# Altium schematic sheet PowerBoard.SchDoc
size B
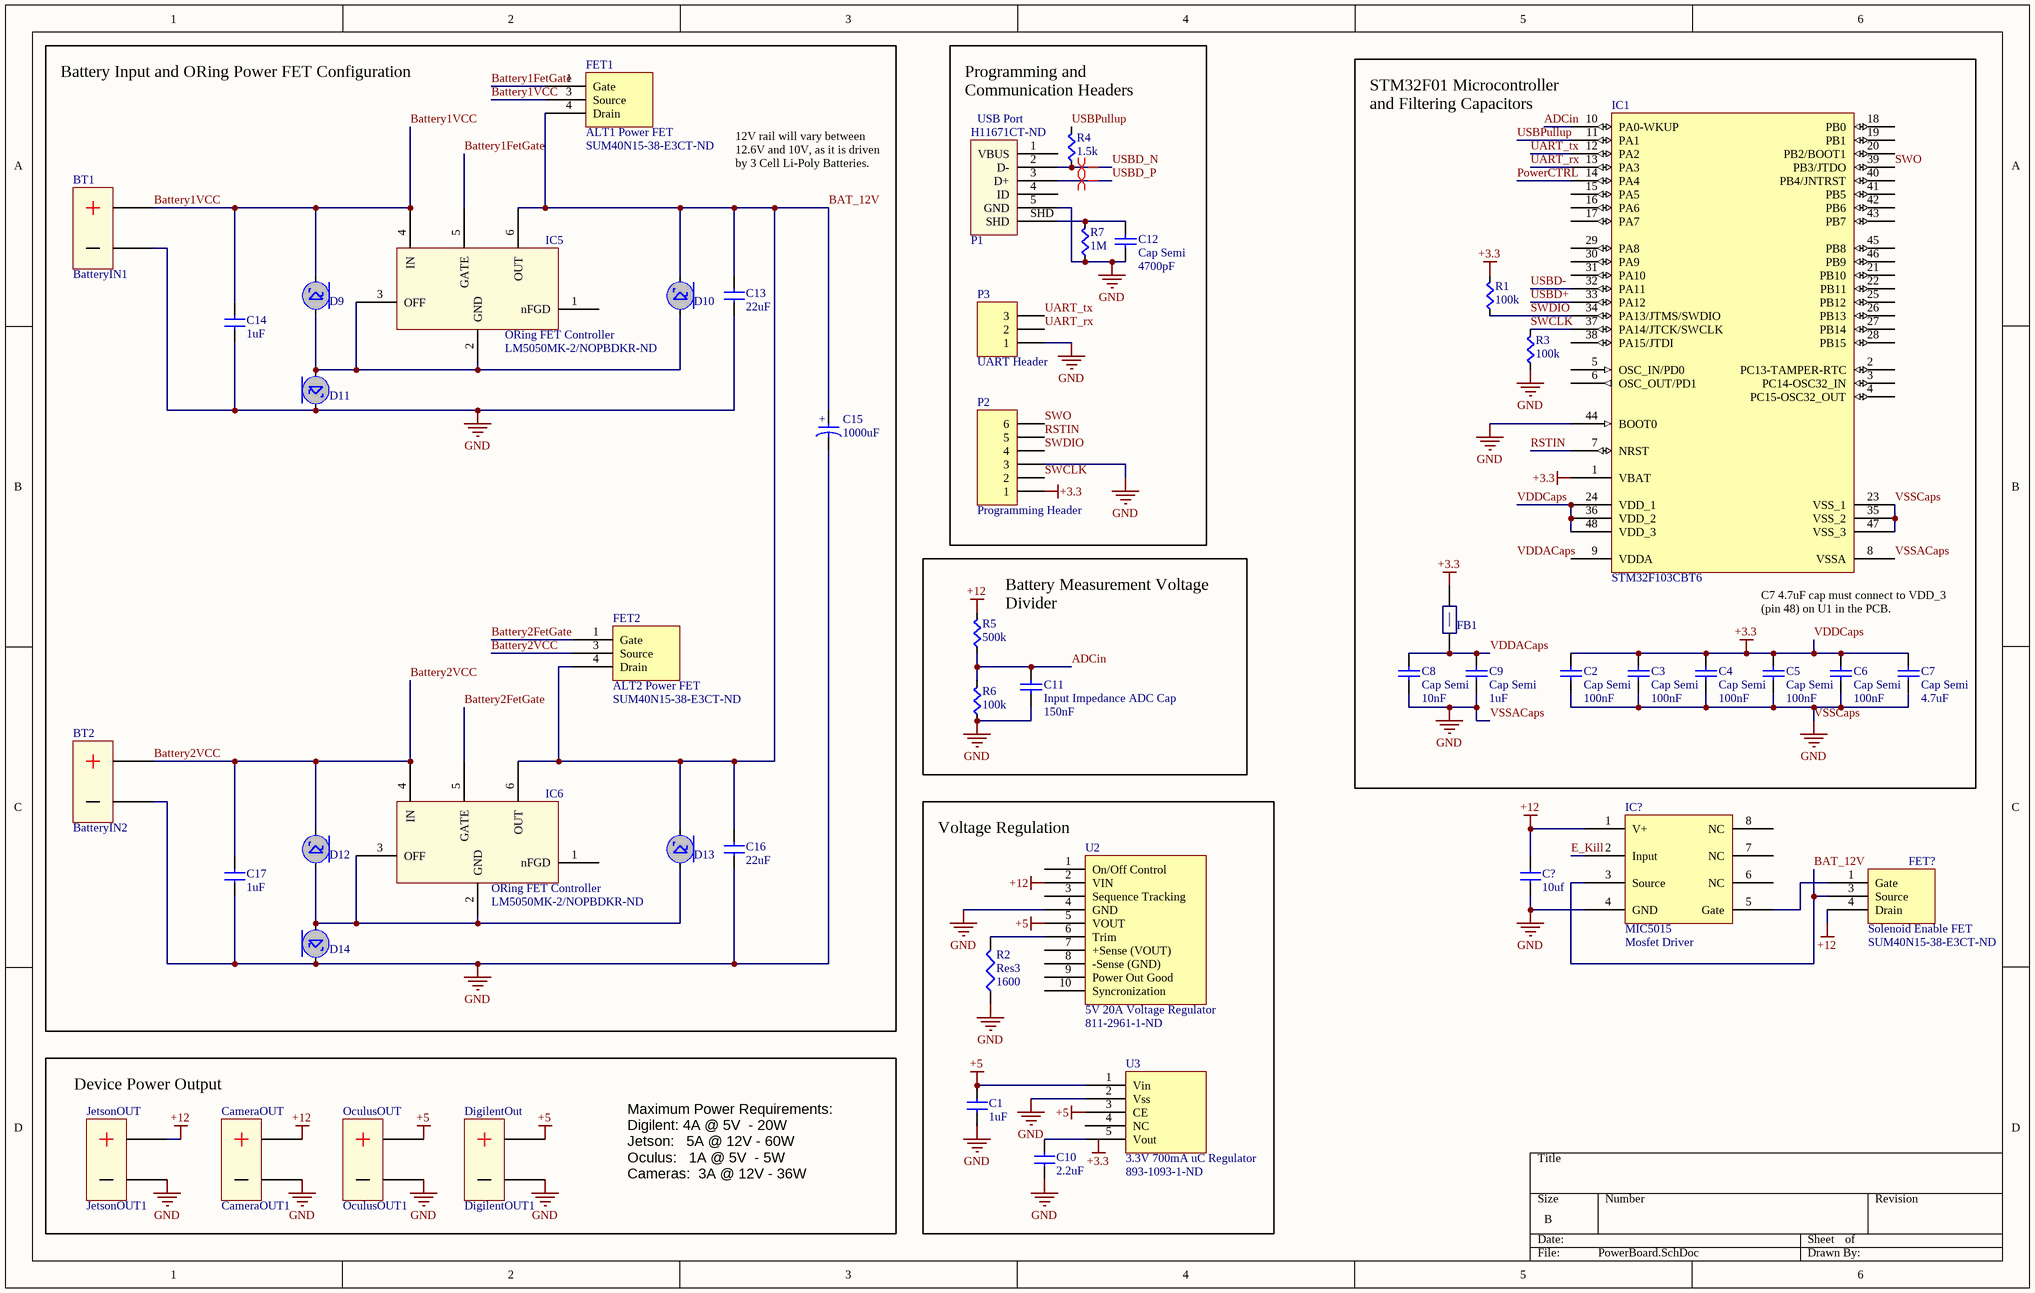
[diagram p0: PowerBoard.SchDoc]

## Parts
BT1  BatteryIN1  [BATWIRE12]
BT2  BatteryIN2  [BATWIRE12]
C1  value 1uF  [CAPC0603]  (hidden comment: Cap)
C2  Cap Semi  value 100nF  [1608[0603]]
C3  Cap Semi  value 100nF  [1608[0603]]
C4  Cap Semi  value 100nF  [1608[0603]]
C5  Cap Semi  value 100nF  [1608[0603]]
C6  Cap Semi  value 100nF  [1608[0603]]
C7  Cap Semi  value 4.7uF  [1608[0603]]
C8  Cap Semi  value 10nF  [1608[0603]]
C9  Cap Semi  value 1uF  [1608[0603]]
C10  value 2.2uF  [CAPC0603]  (hidden comment: Cap)
C11  Input Impedance ADC Cap  value 150nF  [1608[0603]]
C12  Cap Semi  value 4700pF  [1608[0603]]
C13  value 22uF  [CAPC0603]  (hidden comment: Cap)
C14  value 1uF  [CAPC0603]  (hidden comment: Cap)
C15  value 1000uF  [CAP1000uF]  (hidden comment: CapPol)
C16  value 22uF  [CAPC0603]  (hidden comment: Cap)
C17  value 1uF  [CAPC0603]  (hidden comment: Cap)
C?  value 10uf  [CAPC0805]  (hidden comment: Cap)
CameraOUT1  CameraOUT  [BATWIRE12]
D9  SS16T3G  [SS16T3G]  (value not drawn)
D10  SS16T3G  [SS16T3G]  (value not drawn)
D11  SS16T3G  [SS16T3G]  (value not drawn)
D12  SS16T3G  [SS16T3G]  (value not drawn)
D13  SS16T3G  [SS16T3G]  (value not drawn)
D14  SS16T3G  [SS16T3G]  (value not drawn)
DigilentOUT1  DigilentOut  [BATWIRE12]
FB1  FBead  [RES0603]  (value not drawn)
FET1  ALT1 Power FET  Supplier Part Number 1: SUM40N15-38-E3CT-ND  [TO-263AB]
FET2  ALT2 Power FET  Supplier Part Number 1: SUM40N15-38-E3CT-ND  [TO-263AB]
FET?  Solenoid Enable FET  Supplier Part Number 1: SUM40N15-38-E3CT-ND  [TO-263AB]
IC1  STM32F103CBT6  [LQFP48_N]
IC5  ORing FET Controller  Supplier Part Number 1: LM5050MK-2/NOPBDKR-ND  [LM5050MK-2/NOPB]
IC6  ORing FET Controller  Supplier Part Number 1: LM5050MK-2/NOPBDKR-ND  [LM5050MK-2/NOPB]
IC?  Mosfet Driver  Part Number: MIC5015  [8-SOIC]
JetsonOUT1  JetsonOUT  [BATWIRE12]
OculusOUT1  OculusOUT  [BATWIRE12]
P1  USB Port  Supplier Part Number 1: H11671CT-ND  [UX60SC-MB-5ST]
P2  Programming Header  [HDR1X6]
P3  UART Header  [HDR1X3]
R1  value 100k  [RES0603]  (hidden comment: Res)
R2  Res3  value 1600  [J1-0603]
R3  value 100k  [RES0603]  (hidden comment: Res)
R4  value 1.5k  [RES0603]  (hidden comment: Res)
R5  value 500k  [RES0603]  (hidden comment: Res)
R6  value 100k  [RES0603]  (hidden comment: Res)
R7  value 1M  [RES0603]  (hidden comment: Res)
U2  5V 20A Voltage Regulator  Supplier Part Number 1: 811-2961-1-ND  [10 iLGA SMD]
U3  3.3V 700mA uC Regulator  Supplier Part Number 1: 893-1093-1-ND  [SOT-25]

## Nets
+5: C1.1(A) DigilentOUT1.+ OculusOUT1.+ U2.5(VOUT) U3.1(Vin) U3.3(CE)
+12: C?.1(A) CameraOUT1.+ FET?.4(Drain) IC?.1(V+) JetsonOUT1.+ R5.1(A) U2.2(VIN)
VDDCaps: C2.2 C3.2 C4.2 C5.2 C6.2 C7.2 FB1.2(B) IC1.1(VBAT) IC1.24(VDD_1) IC1.36(VDD_2) IC1.48(VDD_3) P2.1 R1.1(A)  [also labelled +3.3]
VSSACaps: BT1.- BT2.- C1.2(B) C2.1 C3.1 C4.1 C5.1 C6.1 C7.1 C8.1 C9.1 C10.2(B) C11.1 C12.1 C13.2(B) C14.2(B) C15.2(B) C16.2(B) C17.2(B) C?.2(B) CameraOUT1.- D11.C D14.C DigilentOUT1.- IC1.8(VSSA) IC1.23(VSS_1) IC1.35(VSS_2) IC1.44(BOOT0) IC1.47(VSS_3) IC?.4(GND) JetsonOUT1.- OculusOUT1.- P1.5(GND) P2.3 P3.1 R2.1 R3.2(B) R6.2(B) R7.2(B) U2.4(GND) U3.2(Vss)  [also labelled GND, VSSCaps]
ADCin: C11.2 IC1.10(PA0-WKUP) R5.2(B) R6.1(A)
BAT_12V: C13.1(A) C15.1(A) C16.1(A) D10.C D13.C FET1.4(Drain) FET2.4(Drain) FET?.3(Source) IC5.6(OUT) IC6.6(OUT) IC?.3(Source)
Battery1FetGate: FET1.1(Gate) IC5.5(GATE)
Battery1VCC: BT1.+ C14.1(A) D9.C FET1.3(Source) IC5.4(IN)
Battery2FetGate: FET2.1(Gate) IC6.5(GATE)
Battery2VCC: BT2.+ C17.1(A) D12.C FET2.3(Source) IC6.4(IN)
E_Kill: IC?.2(Input)
PowerCTRL: IC1.14(PA4)
RSTIN: IC1.7(NRST) P2.5
SWCLK: IC1.37(PA14/JTCK/SWCLK) P2.2 R3.1(A)
SWDIO: IC1.34(PA13/JTMS/SWDIO) P2.4 R1.2(B)
SWO: IC1.39(PB3/JTDO) P2.6
UART_rx: IC1.13(PA3) P3.2
UART_tx: IC1.12(PA2) P3.3
USBD+: IC1.33(PA12)
USBD-: IC1.32(PA11)
USBD_N: P1.2(D-) R4.2(B)
USBD_P: P1.3(D+)
USBPullup: IC1.11(PA1) R4.1(A)
VDDACaps: C8.2 C9.2 FB1.1(A)
NetC10_1: C10.1(A) U3.5(Vout)
NetC12_2: C12.2 P1.SHD R7.1(A)
NetD9_A: D9.A D10.A D11.A IC5.2(GND) IC5.3(OFF)
NetD12_A: D12.A D13.A D14.A IC6.2(GND) IC6.3(OFF)
NetFET?_1: FET?.1(Gate) IC?.5(Gate)
NetR2_2: R2.2 U2.6(Trim)

Not connected (* = marked no-connect by the designer): IC1 2(PC13-TAMPER-RTC) 3(PC14-OSC32_IN) 4(PC15-OSC32_OUT) 5(OSC_IN/PD0) 6(OSC_OUT/PD1) 9(VDDA) 15(PA5) 16(PA6) 17(PA7) 18(PB0) 19(PB1) 20(PB2/BOOT1) 21(PB10) 22(PB11) 25(PB12) 26(PB13) 27(PB14) 28(PB15) 29(PA8) 30(PA9) 31(PA10) 38(PA15/JTDI) 40(PB4/JNTRST) 41(PB5) 42(PB6) 43(PB7) 45(PB8) 46(PB9); IC5 1(nFGD); IC6 1(nFGD); IC? 6(NC) 7(NC) 8(NC); P1 1(VBUS) 4(ID); U2 1(On/Off_Control) 3(Sequence_Tracking) 7(+Sense_(VOUT)) 8(-Sense_(GND)) 9(Power_Out_Good) 10(Syncronization); U3 4(NC)

## Layout directives
differential pair: USBD_N, USBD_P

## Notes on the sheet
- Battery Input and ORing Power FET Configuration
- Programming and Communication Headers
- (near IC1) STM32F01 Microcontroller and Filtering Capacitors
- 12V rail will vary between 12.6V and 10V, as it is driven by 3 Cell Li-Poly Batteries.
- (near R5) Battery Measurement Voltage Divider
- (near IC1) C7 4.7uF cap must connect to VDD_3 (pin 48) on U1 in the PCB.
- (near U2) Voltage Regulation
- Device Power Output
- Maximum Power Requirements:
  Digilent: 4A @ 5V  - 20W
  Jetson:   5A @ 12V - 60W
  Oculus:   1A @ 5V  - 5W
  Cameras:  3A @ 12V - 36W
  Total: 121W
- Labels drawn without touching a wire or pin: +3.3, VDDACaps
- (in symbol CapPol) +

## Library data of the parts
BT1 BT2 CameraOUT1 DigilentOUT1 JetsonOUT1 OculusOUT1 = BATWIRE: Two large gauge leads soldered directly to the board.
C2-C9 C11 C12 = Cap Semi: Capacitor (Semiconductor SIM Model); Published: 8-Jun-2000; LatestRevisionDate: 29-May-2009; LatestRevisionNote: IPC-7351 Footprint Added.; PackageReference: C1206; Publisher: Altium Limited; PackageDescription: Chip Capacitor
D9-D14 = SS16T3G: DIODE SCHOTTKY 60V 1A SMA; Supplier 1: Digi-Key; Supplier Part Number 1: SS16T3GOSDKR-ND
FB1 = FBead: Ferrite Bead; Supplier 1: Digi-Key; Supplier Part Number 1: 445-2988-1-ND
FET1 FET2 FET? = SUM40N15-38: MOSFET N-Channel; Supplier 1: Digi-Key
IC1 = STM32F103C8T6: STM32 ARM-based 32-bit MCU with 64 Kbytes Flash, 48-pin LQFP, Industrial Temperature; Published: 30-May-2008; DatasheetVersion: rev6, Mar-2008; PackageVersion: Mar-2008; PackageReference: LQFP48; Publisher: Altium Limited; PackageDescription: 48-Pin Low-Profile Quad Flat Pack, 7 x 7 mm Body, 0.5 mm Pitch (LQFP48); ComponentLink1Description: Manufacturer Link; ComponentLink1URL: www.st.com/stm32; ComponentLink2Description: Datasheet; ComponentLink2URL: http://www.st.com/stonline/products/literature/ds/13587.pdf
IC5 IC6 = LM5050MK-2/NOPB: IC OR CTRLR N+1 6SOT; Supplier 1: Digi-Key
IC? = MIC5014: n-Mosfet Charge Pump; Supplier 1: Digi-Key; Supplier Part Number 1: 576-1235-ND
P1 = UX60SC-MB-5ST: USB Mini B Metal Shield SMT; Supplier 1: Digi-Key
P2 = Header 6: Header, 6-Pin; LatestRevisionDate: 17-Jul-2002; LatestRevisionNote: Re-released for DXP Platform.; Publisher: Altium Limited
P3 = Header 3: Header, 3-Pin; LatestRevisionDate: 17-Jul-2002; LatestRevisionNote: Re-released for DXP Platform.; Publisher: Altium Limited
R2 = Res3: Resistor; Published: 8-Jun-2000; LatestRevisionDate: 29-May-2009; LatestRevisionNote: IPC-7351 Footprint Added.; PackageReference: J1-0603; Publisher: Altium Limited; PackageDescription: Chip Resistor
U2 = Murata OKL2-T/20-W12: DC-DC Regulator; PackageDescription: iLGA SMT; Supplier 1: Digi-Key
U3 = 3VRegulator: Voltage Regulator; Supplier 1: Digi-Key
C1 C10 C13 C14 C16 C17 C? = Cap: Supplier 1: Digi-Key; Supplier Part Number 1: 1276-1000-1-ND
C15 = CapPol: Supplier 1: Digi-Key; Supplier Part Number 1: 565-1618-ND
R1 R3-R7 = Res: Supplier 1: Digi-Key; Supplier Part Number 1: RMCF0603JT10K0CT-ND